# Altium project temperature-controller.PrjPCB
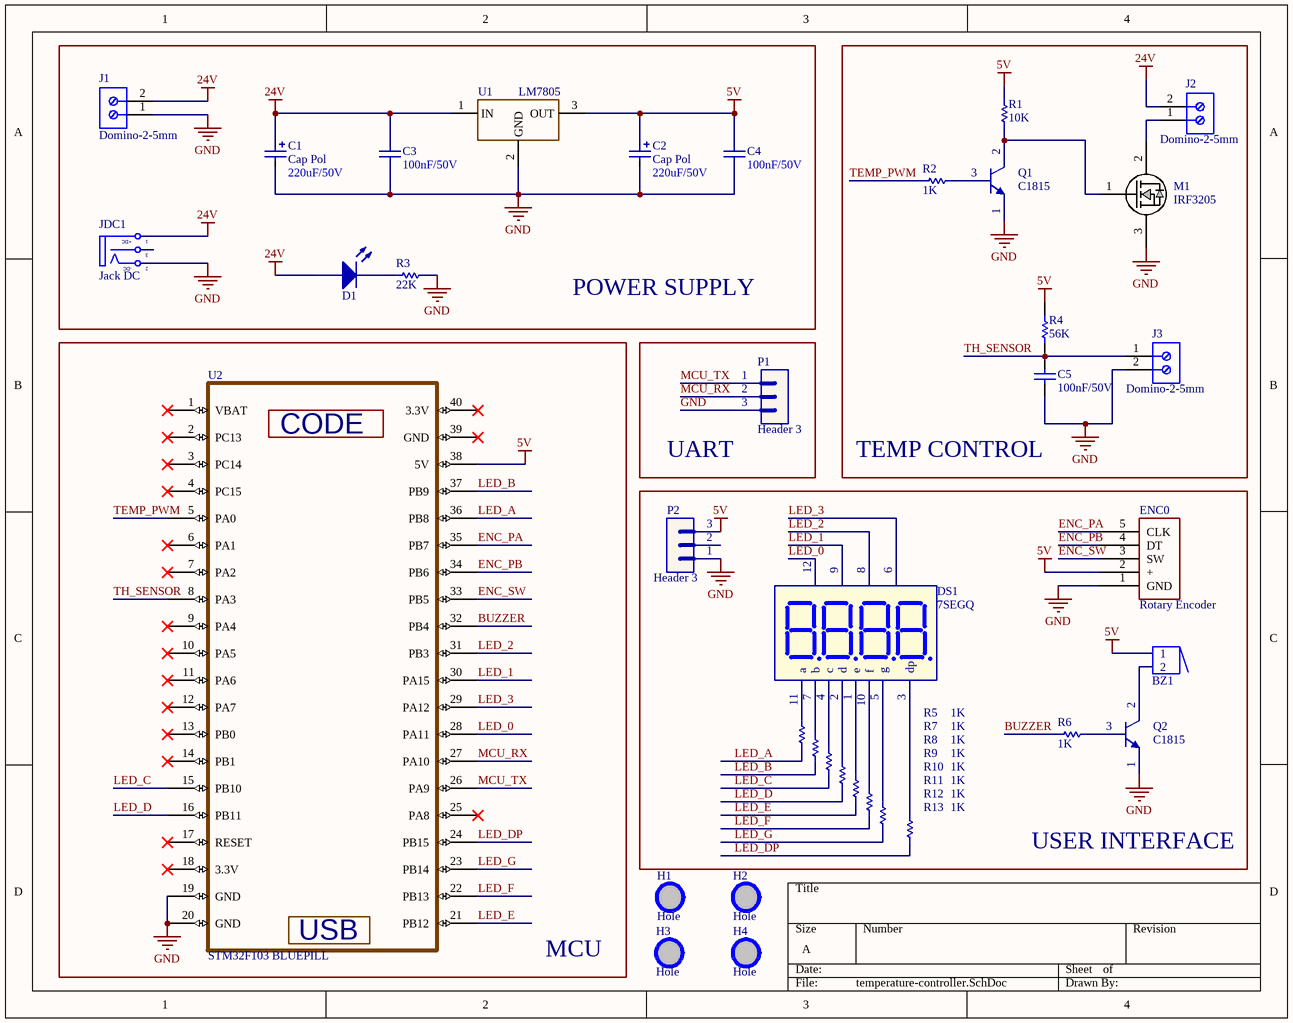
[diagram p0: temperature-controller.SchDoc]
1 sheet, 37 parts. Net scope: global (net labels, ports and power ports of the same name join across sheets).
Board file: temperature-controller.PcbDoc

## Sheet temperature-controller.SchDoc
size A

### Parts
BZ1  Buzzer  [BUZZER]  (value not drawn)
C1  Cap Pol  value 220uF/50V  [CP1.5/2.5]
C2  Cap Pol  value 220uF/50V  [CP1.5/2.5]
C3  value 100nF/50V  [CN1]  (hidden comment: Cap Non-Pol)
C4  value 100nF/50V  [CN1]  (hidden comment: Cap Non-Pol)
C5  value 100nF/50V  [CAP-SM-0805]  (hidden comment: Cap-100nF-50V-0805)
D1  LED  [LED-3mm]  (value not drawn)
DS1  7SEGQ  [7SEGQ]
ENC0  Rotary Encoder  [Rotary-Encoder]
H1  Hole  [HOLE-3mm]
H2  Hole  [HOLE-3mm]
H3  Hole  [HOLE-3mm]
H4  Hole  [HOLE-3mm]
J1  Domino-2-5mm  [DOMINO-2-5MM]
J2  Domino-2-5mm  [DOMINO-2-5MM]
J3  Domino-2-5mm  [DOMINO-2-5MM]
JDC1  Jack DC  [JACK-DC]
M1  IRF3205  [TO220AB]
P1  Header 3  [JP3]
P2  Header 3  [JP3]
Q1  C1815  [QTO-92]
Q2  C1815  [QTO-92]
R1  value 10K  [RES 1/4W]  (hidden comment: Resistor 1/4W)
R2  value 1K  [RES 1/4W]  (hidden comment: Resistor 1/4W)
R3  value 22K  [RES 1/4W]  (hidden comment: Resistor 1/4W)
R4  value 56K  [RES-SM-0805]  (hidden comment: Res-4.7K-0805)
R5  value 1K  [RES 1/4W]  (hidden comment: Resistor 1/4W)
R6  value 1K  [RES 1/4W]  (hidden comment: Resistor 1/4W)
R7  value 1K  [RES 1/4W]  (hidden comment: Resistor 1/4W)
R8  value 1K  [RES 1/4W]  (hidden comment: Resistor 1/4W)
R9  value 1K  [RES 1/4W]  (hidden comment: Resistor 1/4W)
R10  value 1K  [RES 1/4W]  (hidden comment: Resistor 1/4W)
R11  value 1K  [RES 1/4W]  (hidden comment: Resistor 1/4W)
R12  value 1K  [RES 1/4W]  (hidden comment: Resistor 1/4W)
R13  value 1K  [RES 1/4W]  (hidden comment: Resistor 1/4W)
U1  LM7805  [QTO-220]
U2  STM32F103 BLUEPILL  [STM32F103 Bluepill]

### Blocks framed on the sheet
POWER SUPPLY: C1-C4 D1 J1 JDC1 R3 U1
TEMP CONTROL: C5 J2 J3 M1 Q1 R1 R2 R4
MCU: U2
UART: P1
USER INTERFACE: BZ1 DS1 ENC0 P2 Q2 R5-R13

### Nets
5V: BZ1.1 C2.1 C4.2 ENC0.2(+) P2.3 R1.2 R4.2 U1.3(OUT) U2.38(5V)
24V: C1.1 C3.2 D1.1(A) J1.2 J2.2 JDC1.1(T) U1.1(IN)
GND: C1.2 C2.2 C3.1 C4.1 C5.1 ENC0.1(GND) J1.1 J3.2 JDC1.2(TN) M1.3(S) P1.3 P2.1 Q1.1(E) Q2.1(E) R3.2 U1.2(GND) U2.19(GND) U2.20(GND)
BUZZER: R6.1 U2.32(PB4)
ENC_PA: ENC0.5(CLK) U2.35(PB7)
ENC_PB: ENC0.4(DT) U2.34(PB6)
ENC_SW: ENC0.3(SW) U2.33(PB5)
LED_0: DS1.12(V1) U2.28(PA11)
LED_1: DS1.9(V2) U2.30(PA15)
LED_2: DS1.8(V3) U2.31(PB3)
LED_3: DS1.6(V4) U2.29(PA12)
LED_A: R5.1 U2.36(PB8)
LED_B: R7.1 U2.37(PB9)
LED_C: R8.1 U2.15(PB10)
LED_D: R9.1 U2.16(PB11)
LED_DP: R13.1 U2.24(PB15)
LED_E: R10.1 U2.21(PB12)
LED_F: R11.1 U2.22(PB13)
LED_G: R12.1 U2.23(PB14)
MCU_RX: P1.2 U2.27(PA10)
MCU_TX: P1.1 U2.26(PA9)
TEMP_PWM: R2.1 U2.5(PA0)
TH_SENSOR: C5.2 J3.1 R4.1 U2.8(PA3)
NetBZ1_2: BZ1.2 Q2.2(C)
NetD1_2: D1.2(K) R3.1
NetDS1_1: DS1.1(e) R10.2
NetDS1_2: DS1.2(d) R9.2
NetDS1_3: DS1.3(dp) R13.2
NetDS1_4: DS1.4(c) R8.2
NetDS1_5: DS1.5(g) R12.2
NetDS1_7: DS1.7(b) R7.2
NetDS1_10: DS1.10(f) R11.2
NetDS1_11: DS1.11(a) R5.2
NetJ2_1: J2.1 M1.2(D)
NetM1_1: M1.1(G) Q1.2(C) R1.1
NetQ1_3: Q1.3(B) R2.2
NetQ2_3: Q2.3(B) R6.2

Not connected (* = marked no-connect by the designer): H1 1; H2 1; H3 1; H4 1; JDC1 3(S); P2 2; U2 1(VBAT)* 2(PC13)* 3(PC14)* 4(PC15)* 6(PA1)* 7(PA2)* 9(PA4)* 10(PA5)* 11(PA6)* 12(PA7)* 13(PB0)* 14(PB1)* 17(RESET)* 18(3.3V)* 25(PA8)* 39(GND)* 40(3.3V)*

### Notes on the sheet
- (in symbol Jack DC) +DC; -DC
- (in symbol STM32F103 BLUEPILL) CODE; USB

### Library data of the parts
C1 C2 = Cap-TH-Pol: Polarized Capacitor (Radial)
C3 C4 = Cap-TH-NonPol: Capacitor
C5 = Cap-100nF-50V-0805: CAP CER 0.1UF 50V Y5V 0805; Manufacturer: Samsung Electro-Mechanics; Manufacturer Part Number: CL21F104ZBCNNNC; Local Supplier: thegioiic; Local Supplier Link: https://thegioiic.com/products/tu-100nf-0-1uf-50v-0805; Supplier 1: Digikey; Supplier 1 Part Number: 1276-1007-1-ND; Supplier 1 Link: https://www.digikey.com/product-detail/en/samsung-electro-mechanics/CL21F104ZBCNNNC/1276-1007-1-ND/3889093
DS1 = LED7Q: Four 7 Seg Dipslay; Value: LED 7Q SEG
H1-H4 = Hole: Hole 3mm
J1-J3 = Domino-2-5mm: WR-TBL Serie 1347 Horizontal Cable Entry, Pressure Clamp, pitch 5mm, 2p; Part Number: 691134710002; Compliance: Lead free / RoHS; Modularity: Yes; PCB/Cable/Panel: PCB; Pin Number: 2; Rated Current [UL]: 16A; Working Voltage [UL]: 300VAC; ComponentLink1Description: Manufacturer; ComponentLink1URL: http://www.we-online.de; ComponentLink2URL: https://katalog.we-online.de/em/datasheet/691134710002.pdf; ComponentLink2Description: Datasheet; Mounting Technology: THT; Packaging: Box; Operating Temperature: -30 to +120degC; Pitch: 5mm; Published Date: October 2019; Type: Horizontal; Publisher: Wurth Elektronik; Application: Pressure Clamp
JDC1 = Jack DC: Jack DC input; Value: Jac DC
M1 = IRF3205: N-Channel 55V 110A (Tc) 200W (Tc) Through Hole TO-220AB
P1 P2 = Header 3: Header, 3-Pin; LatestRevisionDate: 17-Jul-2002; LatestRevisionNote: Re-released for DXP Platform.; Publisher: Altium Limited
R1-R3 R5 R6 = Res
R4 = Res-4.7K-0805: RES SMD 4.7K OHM 5% 1/8W 0805; Manufacturer: Yageo; Manufacturer Part Number: RC0805JR-074K7L; Local Supplier: thegioiic; Local Supplier Link: https://thegioiic.com/products/dien-tro-4-7k-ohm-0805-5; Supplier 1: Digikey; Supplier 1 Link: https://www.digikey.com/product-detail/en/yageo/RC0805JR-074K7L/311-4.7KARCT-ND/731274; Supplier 1 Part Number: 311-4.7KARCT-ND
R7-R13 = RES
U1 = LM7805: Positive Voltage Regulator